# Altium project Simu.PrjPCB
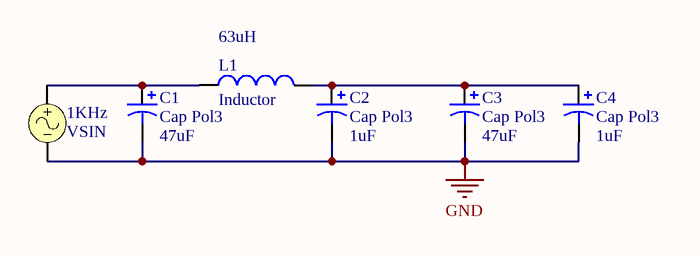
[diagram p0: Alim.SchDoc]
1 sheet, 6 parts. Net scope: global (net labels, ports and power ports of the same name join across sheets).

## Sheet Alim.SchDoc
size A4

### Parts
1KHz  VSIN
C1  Cap Pol3  value 47uF  [CAPC4564L]
C2  Cap Pol3  value 1uF  [CAPC4564L]
C3  Cap Pol3  value 47uF  [CAPC4564L]
C4  Cap Pol3  value 1uF  [CAPC4564L]
L1  Inductor  value 63uH  [INDC3216AL]

### Nets
GND: 1KHz.2 C1.2 C2.2 C3.2 C4.2
Net1KHz_1: 1KHz.1 C1.1 L1.1
NetC2_1: C2.1 C3.1 C4.1 L1.2

### Library data of the parts
1KHz = VSIN: Sinusoidal Voltage Source; Note: PCB Footprint - Not required; Published: 8-Jun-2000; LatestRevisionDate: 15-Nov-2004; LatestRevisionNote: Corrected Netlist.; PackageReference: Not Applicable; Publisher: Altium Limited
C1-C4 = Cap Pol3: Polarized Capacitor (Surface Mount); Published: 8-Jun-2000; LatestRevisionDate: 29-May-2009; LatestRevisionNote: IPC-7351 Footprint Added.; PackageReference: C0805; Publisher: Altium Limited; PackageDescription: Chip Capacitor
L1 = Inductor: Code_IEC: 1005; Published: 8-Jun-2000; LatestRevisionDate: 29-May-2009; LatestRevisionNote: IPC-7351 Footprint Added.; PackageReference: 0402-A; Publisher: Altium Limited; PackageDescription: Chip Inductor; Code_JEITA: 0402